# EAGLE design v1.0 (EAGLE 7.7.0)
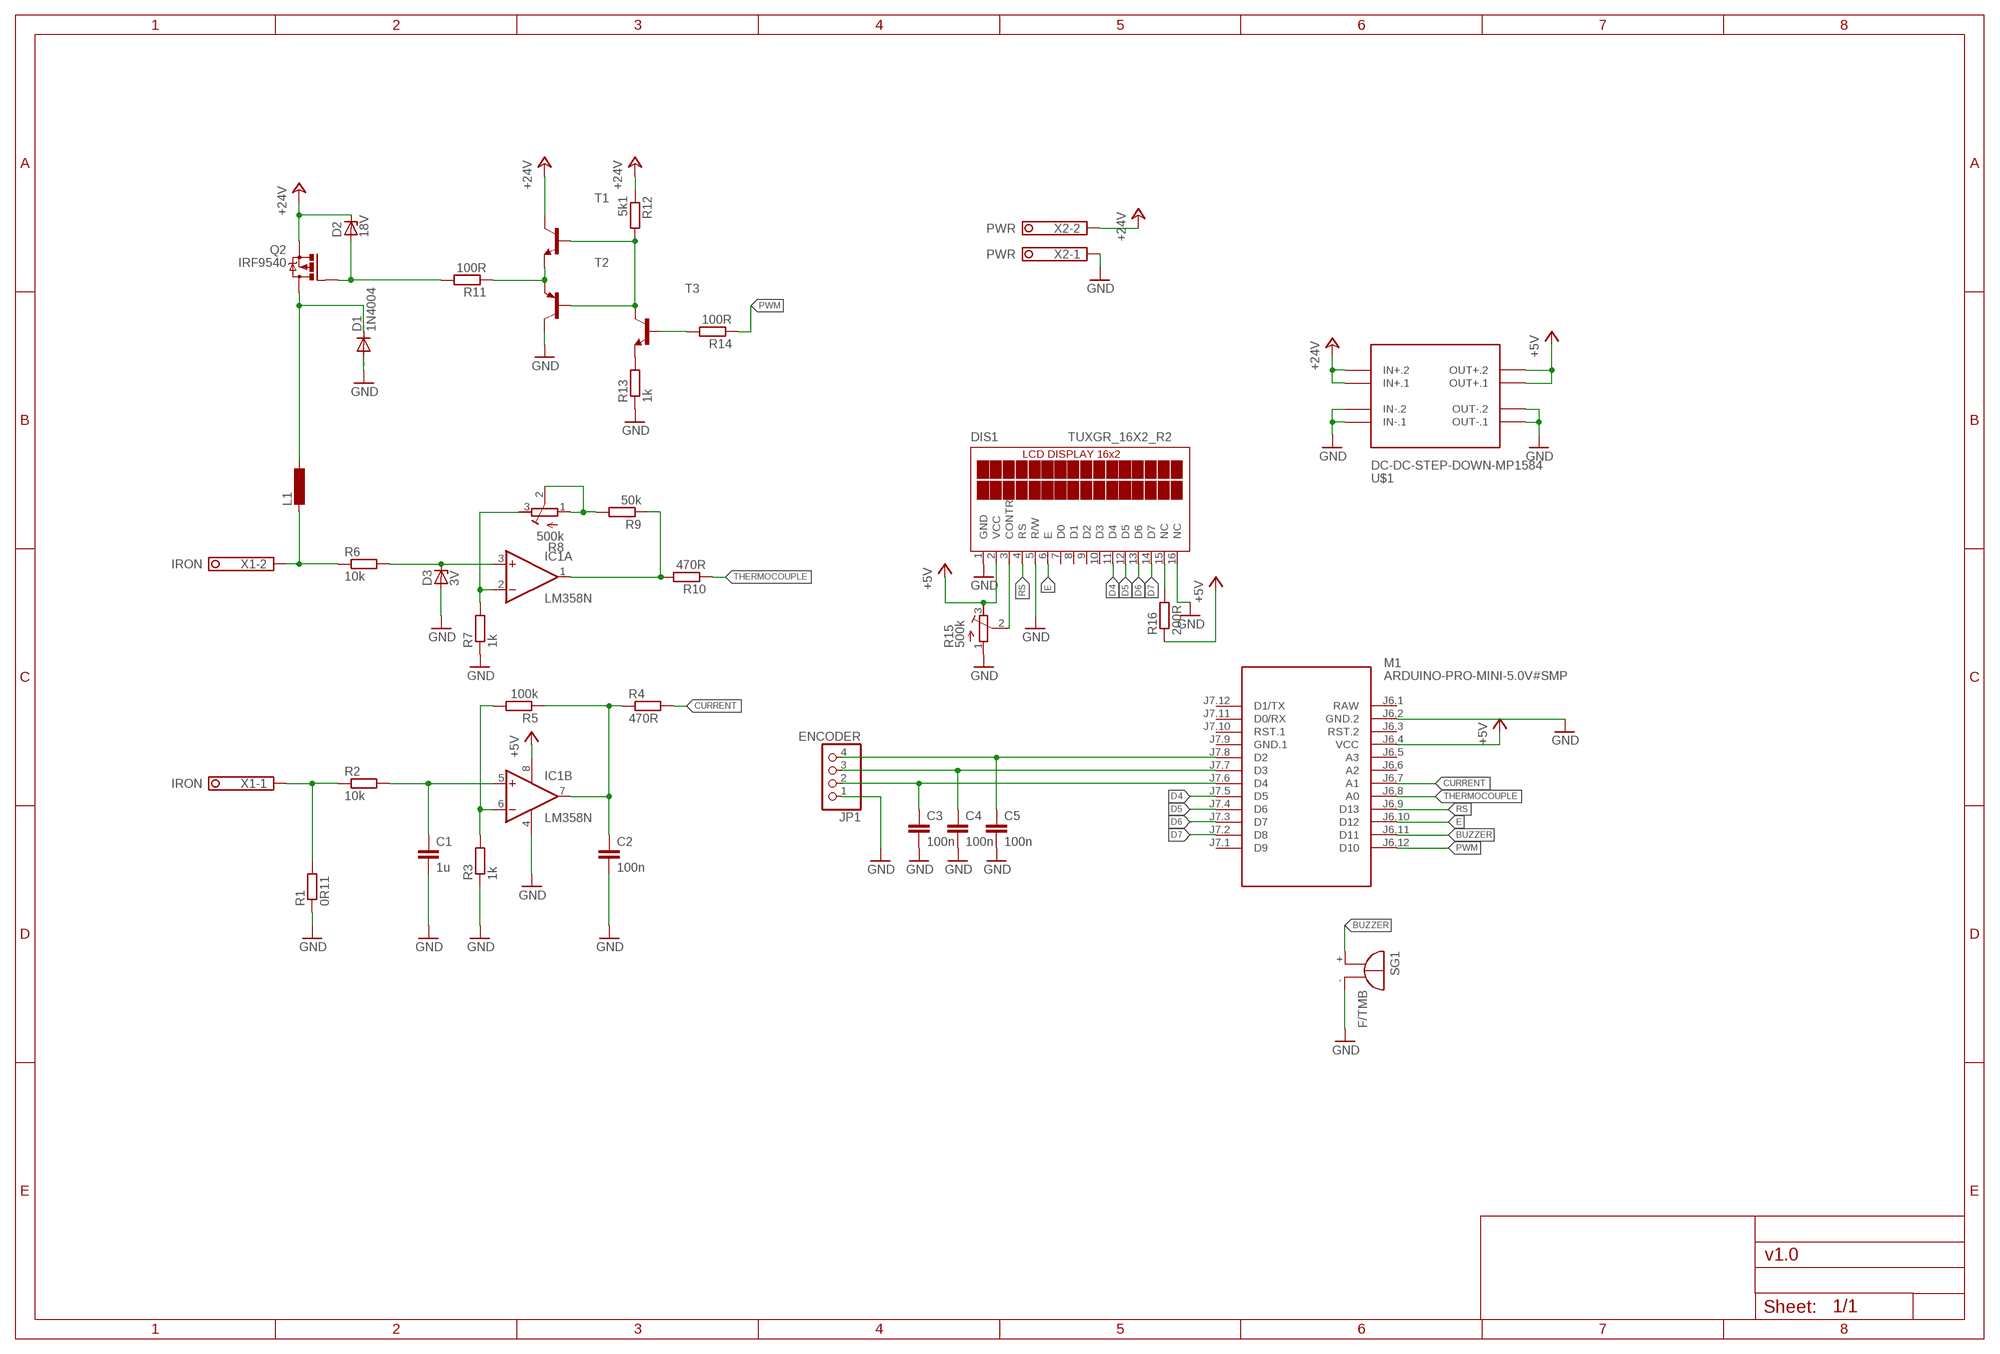
[diagram p0: schematic, sheet 1]

## Parts
C1  1u  C-EU025-025X050  [C025-025X050]
C2  100n  C-EU025-025X050  [C025-025X050]
C3  100n  C-EU025-025X050  [C025-025X050]
C4  100n  C-EU025-025X050  [C025-025X050]
C5  100n  C-EU025-025X050  [C025-025X050]
D1  1N4004  [DO41-10]
D2  18V  ZENER-DIODEDO35Z10  [DO35Z10]
D3  3V  ZENER-DIODEDO35Z10  [DO35Z10]
DIS1  TUXGR_16X2_R2  [TUXGR_16X2_R2]
IC1  LM358N  [DIL08]
JP1  ENCODER  PINHD-1X4  [1X04]
L1  L-EULAL02  [LAL02]
M1  ARDUINO-PRO-MINI-5.0V#SMP  [ARDUINO-PRO-MINI#SMP]
Q2  IRF9540  IRF9530  [TO220BV]
R1  0R11  R-EU_0617/22  [0617/22]
R2  10k  R-EU_0204/7  [0204/7]
R3  1k  R-EU_0204/7  [0204/7]
R4  470R  R-EU_0204/7  [0204/7]
R5  100k  R-EU_0204/7  [0204/7]
R6  10k  R-EU_0204/7  [0204/7]
R7  1k  R-EU_0204/7  [0204/7]
R8  500k  R-TRIMM3296Y  [RTRIM3296Y]
R9  50k  R-EU_0204/7  [0204/7]
R10  470R  R-EU_0204/7  [0204/7]
R11  100R  R-EU_0204/7  [0204/7]
R12  5k1  R-EU_0204/7  [0204/7]
R13  1k  R-EU_0204/7  [0204/7]
R14  100R  R-EU_0204/7  [0204/7]
R15  500k  R-TRIMM3296Y  [RTRIM3296Y]
R16  200R  R-EU_0204/7  [0204/7]
SG1  F/TMB  [F/TMB]
T1  BC547-NPN-TO92-CBE  [TO92-CBE]
T2  BC557A-PNP-TO92-EBC  [TO92-EBC]
T3  BC547-NPN-TO92-CBE  [TO92-CBE]
U$1  DC-DC-STEP-DOWN-MP1584  [DC-DC-STEP-DOWN-MP1584]
X1  IRON  1751248  [1751248]
X2  PWR  1751248  [1751248]

## Nets
+5V: DIS1.2(VCC) IC1.8(P:V+) M1.J6.4(VCC) R15.3(E) R16.1 U$1.OUT+.1 U$1.OUT+.2
+24V: D2.C Q2.S R12.1 T1.C U$1.IN+.1 U$1.IN+.2 X2.2
BUZZER: M1.J6.11(D11) SG1.+
CURRENT: M1.J6.7(A1) R4.2
D4: DIS1.11(D4) M1.J7.5(D5)
D5: DIS1.12(D5) M1.J7.4(D6)
D6: DIS1.13(D6) M1.J7.3(D7)
D7: DIS1.14(D7) M1.J7.2(D8)
E: DIS1.6(E) M1.J6.10(D12)
GND: C1.2 C2.2 C3.2 C4.2 C5.2 D1.A D3.A DIS1.1(GND) DIS1.5(R/W) DIS1.16(NC) IC1.4(P:V-) JP1.1 M1.J6.2(GND.2) R1.1 R3.1 R7.1 R13.1 R15.1(A) SG1.- T2.C U$1.IN-.1 U$1.IN-.2 U$1.OUT-.1 U$1.OUT-.2 X2.1
HEATER+: L1.2 R6.1 X1.2
HEATER-: R1.2 R2.1 X1.1
N$2: C1.1 IC1.5(B:+IN) R2.2
N$4: IC1.6(B:-IN) R3.2 R5.2
N$5: C2.1 IC1.7(B:OUT) R4.1 R5.1
N$6: D3.C IC1.3(A:+IN) R6.2
N$7: IC1.2(A:-IN) R7.2 R8.3(E)
N$8: R8.1(A) R8.2(S) R9.2
N$9: IC1.1(A:OUT) R9.1 R10.2
N$10: D1.C L1.1 Q2.D
N$11: R12.2 T1.B T2.B T3.C
N$12: D2.A Q2.G R11.2
N$13: R11.1 T1.E T2.E
N$14: R13.2 T3.E
N$15: R14.2 T3.B
N$16: C5.1 JP1.4 M1.J7.8(D2)
N$17: C4.1 JP1.3 M1.J7.7(D3)
N$18: C3.1 JP1.2 M1.J7.6(D4)
N$19: DIS1.3(CONTR) R15.2(S)
N$28: DIS1.15(NC) R16.2
PWM: M1.J6.12(D10) R14.1
RS: DIS1.4(RS) M1.J6.9(D13)
THERMOCOUPLE: M1.J6.8(A0) R10.1
Unconnected: DIS1.7(D0) DIS1.8(D1) DIS1.9(D2) DIS1.10(D3) M1.J6.3(RST.2) M1.J6.5(A3) M1.J6.6(A2) M1.J7.1(D9) M1.J7.10(RST.1) M1.J7.11(D0/RX) M1.J7.12(D1/TX)

## Power pins joined to a net without a drawn wire
GND.1: M1.J7.9(GND.1)
RAW: M1.J6.1(RAW)

## Library data of the parts
C1-C5 = rcl:C-EU: CAPACITOR, European symbol
D1 = diode:1N4004: DIODE general purpose rectifier, 1 A
D2 D3 = diode:ZENER-DIODE: Z-Diode
DIS1 = display-lcd:TUXGR_16X2_R2: Tuxgraphics LCD display 16x2 characters reflective, without background light Source: tuxgr_12x2_r2.pdf; OC_FARNELL: unknown; OC_NEWARK: unknown
IC1 = linear:LM358: OP AMP also LM158; LM258; LM2904 Source: http://cache.national.com/ds/LM/LM158.pdf
JP1 = pinhead:PINHD-1X4: PIN HEADER
L1 = rcl:L-EU: INDUCTOR, European symbol
M1 = diy-modules:ARDUINO-PRO-MINI-*#SMP: Arduino Pro Mini (and compatible devices) with 2 connectors only More details available here: https://www.arduino.cc/en/Main/ArduinoBoardProMini Click here to find device on ebay.com <http://www.ebay.com/sch/arduino+pro+mini>
Q2 = transistor-power:IRF9530: P-CHANNEL HEXFET POWER-MOS-FET Source: http://www.irf.com/product-info/datasheets/data/irf9530.pdf
R1-R7 R9-R14 R16 = rcl:R-EU_: RESISTOR, European symbol
R8 R15 = rcl:R-TRIMM: Trimm resistor
SG1 = buzzer:F/TMB: BUZZER Source: Buerklin; OC_FARNELL: unknown; OC_NEWARK: unknown
T1 T3 = transistor:*-NPN-: NPN Transistror BF959 corrected 2008.03.06
T2 = transistor:*-PNP-: PNP Transistror
U$1 = diy-modules:DC-DC-STEP-DOWN-MP1584: DC/DC Step-Down Regulator based on MP1584 chip MP1584 datasheet available here: http://www.haoyuelectronics.com/Attachment/MP1584/MP1584.pdf Click here to find device on ebay.com <http://www.ebay.com/sch/mp1584+module>
X1 X2 = con-phoenix-350:1751248: MKDS 1/ 2-3,5 Printklemme Nennstrom: 10 A Bemessungsspannung: 160 V Raster: 3,5 mm Polzahl: 2 Montageart: Löten Anschlussart: Schraubanschluss Anschlussrichtung vom Leiter zur Platine: 0° Source: http://eshop.phoenixcontact.com .. 1751248.pdf; OC_FARNELL: unknown; OC_NEWARK: unknown

## Board
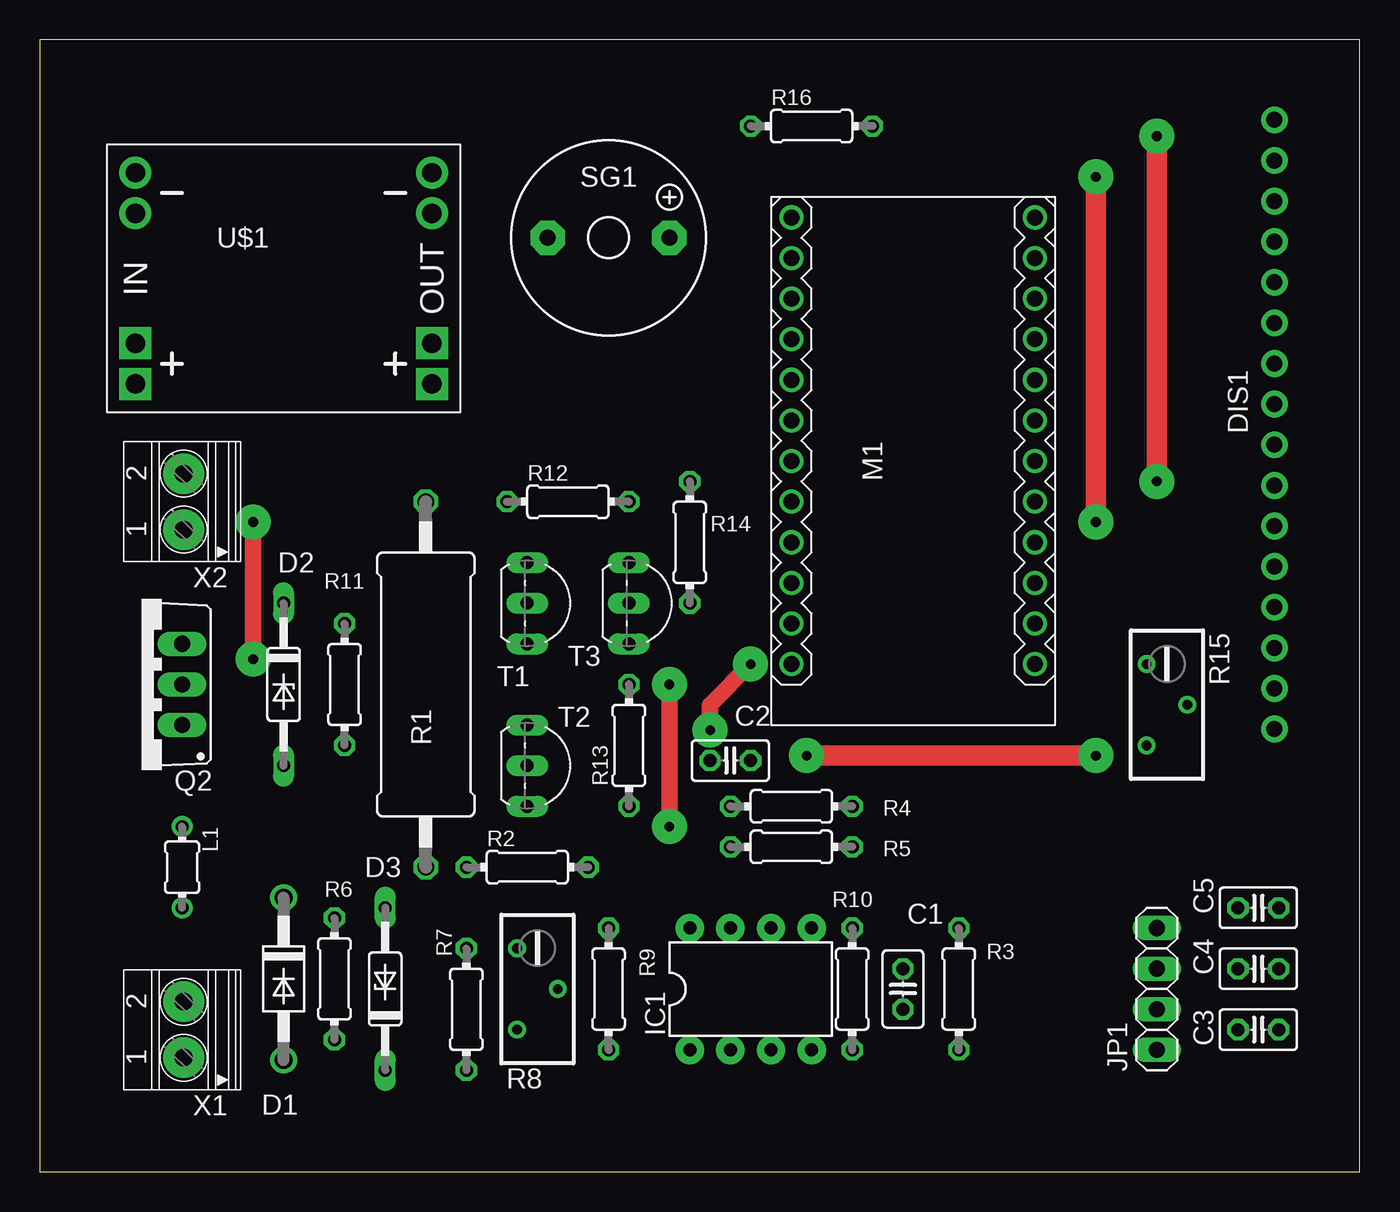
[diagram p1: board, top side]
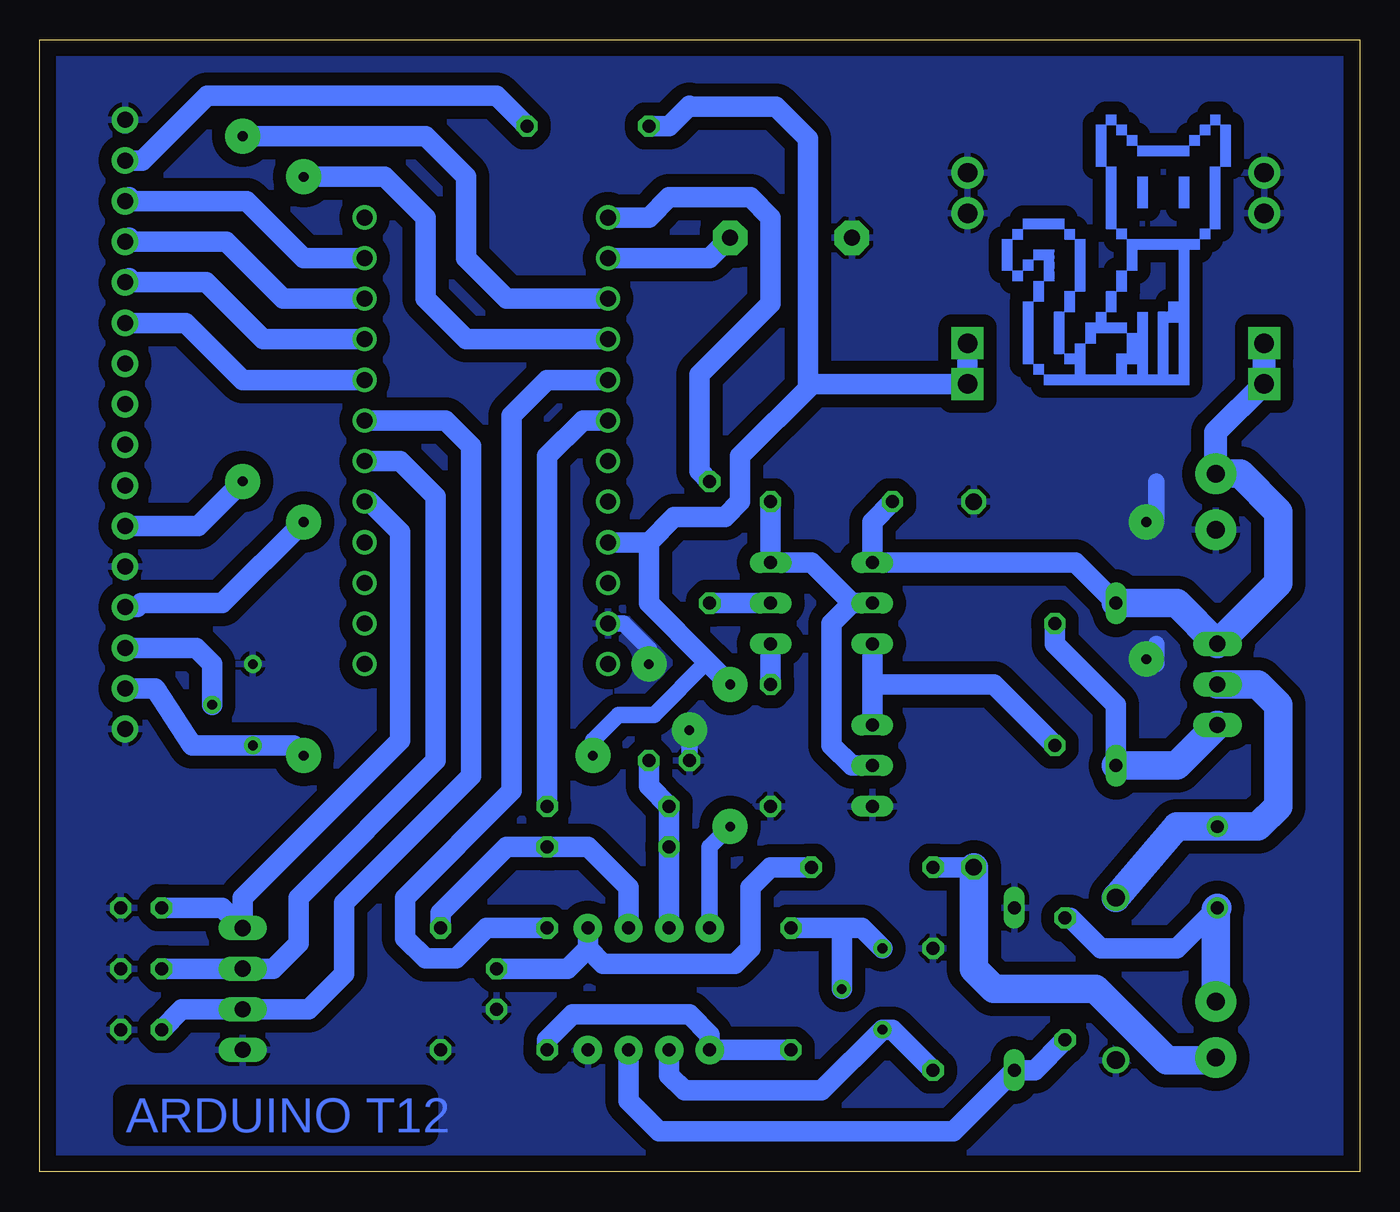
[diagram p2: board, bottom side, seen from below]

Size 82.53 x 70.79 mm. Coordinates in mm from the lower left corner, seen from the top.
Outline: 0,0 82.53,0 82.53,70.79 0,70.79 0,0
Copper layers (1*16): Top 0.035mm / dielectric 1.5mm / Bottom 0.035mm
Design rules "default *": minimum track width 1mil, minimum drill 12mil, track to track 8mil, track to pad 8mil, pad to pad 8mil, via to via 8mil, smd to smd 8mil, copper to edge 40mil, drill to drill 8mil, minimum pad ring 10mil, minimum via ring 8mil, stop-mask expansion 4mil, vias tented up to drill 0mil, thermal gap 10mil

### Footprints (pad centres in the part's own frame; a part is rotated, then mirrored left to right if it is on the bottom)
C025-025X050 = drill 0.813 octagon: 1 -1.27,0; 2 1.27,0
DO41-10 = drill 1.118: A 5.08,0; C -5.08,0
DO35Z10 = drill 0.813 long: A 5.08,0; C -5.08,0
TUXGR_16X2_R2 = drill 1 pad 1.676: 1 -32,15.5; 2 -29.46,15.5; 3 -26.92,15.5; 4 -24.38,15.5; 5 -21.84,15.5; 6 -19.3,15.5; 7 -16.76,15.5; 8 -14.22,15.5; 9 -11.68,15.5; 10 -9.14,15.5; 11 -6.6,15.5; 12 -4.06,15.5; 13 -1.52,15.5; 14 1.02,15.5; 15 3.56,15.5; 16 6.1,15.5
DIL08 = drill 0.813 pad 1.778: 1 -3.81,-3.81; 2 -1.27,-3.81; 3 1.27,-3.81; 4 3.81,-3.81; 5 3.81,3.81; 6 1.27,3.81; 7 -1.27,3.81; 8 -3.81,3.81
1X04 = drill 1.016 long: 1 -3.81,0; 2 -1.27,0; 3 1.27,0; 4 3.81,0
LAL02 = drill 0.8 pad 1.3: 1 -2.54,0; 2 2.54,0
ARDUINO-PRO-MINI#SMP = drill 1: J6.1 -12.7,7.62; J6.2 -10.16,7.62; J6.3 -7.62,7.62; J6.4 -5.08,7.62; J6.5 -2.54,7.62; J6.6 0,7.62; J6.7 2.54,7.62; J6.8 5.08,7.62; J6.9 7.62,7.62; J6.10 10.16,7.62; J6.11 12.7,7.62; J6.12 15.24,7.62; J7.1 15.24,-7.62; J7.2 12.7,-7.62; J7.3 10.16,-7.62; J7.4 7.62,-7.62; J7.5 5.08,-7.62; J7.6 2.54,-7.62; J7.7 0,-7.62; J7.8 -2.54,-7.62; J7.9 -5.08,-7.62; J7.10 -7.62,-7.62; J7.11 -10.16,-7.62; J7.12 -12.7,-7.62
TO220BV = drill 1.016 long: D 0,-2.54; G -2.54,-2.54; S 2.54,-2.54
0617/22 = drill 1.016 octagon: 1 -11.43,0; 2 11.43,0
0204/7 = drill 0.813 octagon: 1 -3.81,0; 2 3.81,0
RTRIM3296Y = drill 0.61: 1 1.27,-2.54; 2 -1.27,0; 3 1.27,2.54
F/TMB = drill 1.016 pad 2.159 octagon: + 3.81,0; - -3.81,0
TO92-CBE = drill 0.813 long: B 0,0; C -2.54,0; E 2.54,0
TO92-EBC = drill 0.813 long: B 0,-1.27; C 2.54,-1.27; E -2.54,-1.27
DC-DC-STEP-DOWN-MP1584 = drill 1.2 pad 2 square: IN+.1 -9.271,-4.064; IN+.2 -9.271,-6.604; OUT+.1 9.271,-4.064; OUT+.2 9.271,-6.604 | drill 1.2 pad 2: IN-.1 -9.271,6.604; IN-.2 -9.271,4.064; OUT-.1 9.271,6.604; OUT-.2 9.271,4.064
1751248 = drill 1.1 pad 2.54: 1 -1.75,-0.1; 2 1.75,-0.1

### Placement (x,y rotation side)
C1  53.98,11.43 270 top
C2  43.18,25.72 180 top
C3  76.2,8.89 0 top
C4  76.2,12.7 0 top
C5  76.2,16.51 0 top
D1  15.24,12.06 270 top
D2  15.24,30.48 270 top
D3  21.59,11.43 90 top
DIS1  92.71,59.69 90 top
IC1  44.45,11.43 0 top
JP1  69.85,11.43 90 top
L1  8.89,19.05 270 top
M1  54.61,44.45 90 top
Q2  6.35,30.48 90 top
R1  24.13,30.48 270 top
R2  30.48,19.05 0 top
R3  57.47,11.43 90 top
R4  46.99,22.86 0 top
R5  46.99,20.32 0 top
R6  18.41,12.06 270 top
R7  26.67,10.16 270 top
R8  31.11,11.43 180 top
R9  35.56,11.43 90 top
R10  50.8,11.43 270 top
R11  19.05,30.48 90 top
R12  33.02,41.91 0 top
R13  36.83,26.67 90 top
R14  40.64,39.37 270 top
R15  70.48,29.21 180 top
R16  48.26,65.41 0 top
SG1  35.56,58.42 0 top
T1  30.48,35.56 270 top
T2  31.75,25.4 270 top
T3  36.83,35.56 270 top
U$1  15.24,55.88 0 top
X1  8.89,8.89 90 top
X2  8.89,41.91 90 top

### Tracks (layer width: path | path; a pad name or v marks a point on that pad's centre or on a via)
+5V  (via drill 0.6 pad 2.18)
  Top 1.016: v39.37,21.59 v39.37,30.48
  Top 1.27: v47.94,26.04 v66.04,26.04
  Bottom 1.016: IC1.8 40.64,20.32 v39.37,21.59 | v47.94,26.04 47.94,26.99 46.35,28.57 44.13,28.57 40.8,31.91
  Bottom 1.27: DIS1.2 75.31,30.23 73.03,26.67 R15.3 66.67,26.67 v66.04,26.04 | v39.37,30.48 40.8,31.91 44.45,35.56 44.45,39.37 | U$1.OUT+.1 U$1.OUT+.2 34.23,49.28 | 34.23,49.28 38.73,44.77 38.73,41.91 39.69,40.96 42.86,40.96 44.45,39.37 | M1.J6.4 44.45,39.37 | R16.1 43.18,65.41 41.91,66.67 41.86,66.62 36.5,66.62 34.49,64.62 34.49,49.28 34.23,49.28
+24V
  Bottom 1.27: D2.C 17.78,38.1 T1.C 30.48,40.64 R12.1
  Bottom 1.422: X2.2 8.99,46.26 U$1.IN+.2 U$1.IN+.1
  Bottom 1.778: X2.2 7.46,43.66 5.08,41.27 5.08,36.83 Q2.S 11.43,35.56 D2.C
BUZZER
  Bottom 1.27: SG1.+ 40.64,57.15 M1.J6.11
CURRENT
  Bottom 1.27: R4.2 50.8,44.77 48.58,46.99 M1.J6.7
D4
  Bottom 1.27: M1.J7.5 69.85,49.53 73.41,53.09 DIS1.11
D5
  Bottom 1.27: 76.96,55.88 DIS1.12 72.14,55.63 68.58,52.07 M1.J7.4
D6
  Bottom 1.27: 76.96,58.42 DIS1.13 70.87,58.17 67.31,54.61 M1.J7.3
D7
  Bottom 1.27: 76.96,60.96 DIS1.14 69.6,60.71 66.04,57.15 M1.J7.2
E  (via drill 0.6 pad 2.18)
  Top 1.27: v69.85,64.77 v69.85,43.18
  Bottom 1.27: M1.J6.10 53.34,54.61 55.88,57.15 55.88,62.23 58.42,64.77 v69.85,64.77 | v69.85,43.18 72.64,40.39 DIS1.6
GND  (via drill 0.6 pad 2.18)
  Top 1.016: v13.34,40.64 v13.34,32.07 | v41.91,27.62 41.91,29.21 v44.45,31.75
  Bottom 1.016: 12.7,43.18 12.7,40.64 v13.34,40.64 | v13.34,32.07 12.7,33.02 12.7,31.75 | C2.2 v41.91,27.62 | v44.45,31.75 44.45,32.7 46.04,34.29 M1.J6.2
  pour Bottom (isolate 0.813): 0,71.12 0,0 82.55,0 82.55,71.12
HEATER+
  Bottom 1.27: 8.99,16.41 11.43,13.97 16.19,13.97 18.1,15.88 R6.1
  Bottom 1.778: L1.2 8.99,16.41 X1.2
HEATER-
  Bottom 1.27: R2.1 R1.2
  Bottom 1.778: X1.1 9.14,6.99 12.06,6.99 16.51,11.43 22.86,11.43 24.13,12.7 R1.2
N$2
  Bottom 1.27: R2.2 36.83,19.05 38.1,17.78 38.1,13.97 39.05,13.02 47.31,13.02 48.26,13.97 | 48.26,13.97 IC1.5 | C1.1 49.53,12.7 48.26,13.97
N$4
  Bottom 1.27: IC1.6 45.72,17.78 48.26,20.32 R5.2 53.34,20.32 57.47,16.19 R3.2
N$5
  Bottom 1.27: IC1.7 R5.1 R4.1 44.45,24.13 C2.1
N$6
  Bottom 1.27: R6.2 20.32,6.35 D3.C 25.4,2.54 43.81,2.54 45.72,4.45 IC1.3
N$7
  Bottom 1.27: R7.2 29.21,8.89 R8.3 33.66,5.08 42.23,5.08 43.18,6.03 IC1.2
N$8
  Bottom 1.27: R8.1 31.11,15.24 32.38,15.24 | 32.38,15.24 R9.2 | R8.2 32.38,15.24
N$9
  Bottom 1.27: R9.1 IC1.1 40.64,8.57 41.91,9.84 49.21,9.84 50.8,8.26 R10.2
N$10
  Bottom 1.778: Q2.D 6.35,30.48 5.08,29.21 5.08,22.86 6.35,21.59 L1.1 11.43,21.59 D1.C
N$11
  Bottom 1.27: T2.B 31.75,25.4 33.02,26.67 33.02,34.29 31.75,35.56 | 31.75,35.56 T1.B | 31.75,35.56 34.29,38.1 T3.C R12.2
N$12
  Bottom 1.27: D2.A 15.24,29.21 19.05,33.02 R11.2
  Bottom 1.778: Q2.G 11.43,25.4 D2.A
N$13
  Bottom 1.27: R11.1 22.86,30.48 30.48,30.48 | 30.48,30.48 T1.E | T2.E 30.48,30.48
N$14
  Bottom 1.27: R13.2 T3.E
N$15
  Bottom 1.27: R14.2 T3.B
N$16
  Bottom 1.27: C5.1 71.12,16.51 JP1.4 69.85,17.14 60.01,26.99 60.01,40.01 61.91,41.91 M1.J7.8
N$17
  Bottom 1.27: C4.1 JP1.3 67.94,12.7 66.36,14.29 66.36,17.14 57.78,25.72 57.78,42.23 60.01,44.45 M1.J7.7
N$18
  Bottom 1.27: C3.1 73.66,10.16 JP1.2 65.72,10.16 63.5,12.38 63.5,16.83 55.56,24.77 55.56,45.4 57.15,46.99 M1.J7.6
N$19
  Bottom 1.27: R15.2 71.75,31.75 72.78,32.77 DIS1.3
N$28
  Bottom 1.27: R16.2 53.98,67.31 72.07,67.31 76.13,63.25 DIS1.15
PWM
  Bottom 1.27: R14.1 41.27,43.81 41.27,49.85 36.83,54.29 36.83,59.69 38.1,60.96 43.18,60.96 44.45,59.69 M1.J6.12
RS  (via drill 0.6 pad 2.18)
  Top 1.27: v66.04,62.23 v66.04,40.64
  Bottom 1.27: M1.J6.9 55.88,52.07 58.42,54.61 58.42,59.69 60.96,62.23 v66.04,62.23 | v66.04,40.64 71.12,35.56 76.2,35.56 76.45,35.31 DIS1.4
THERMOCOUPLE
  Bottom 1.27: R10.1 54.61,15.24 56.52,13.34 58.42,13.34 59.69,14.61 59.69,17.14 53.02,23.81 53.02,47.31 50.8,49.53 M1.J6.8
(copper drawn outside any net)
  shapes: Bottom area x2679

### Text on the board
Bottom: ARDUINO T12
201bmp: C:/Users/Pawel/Desktop/cat-kitten-pixel-art-png-favpng-qzsDGA3F0YewjrLrpUTS7tUAc.bmp